# Altium project PCB_pibs_2u.PrjPcb
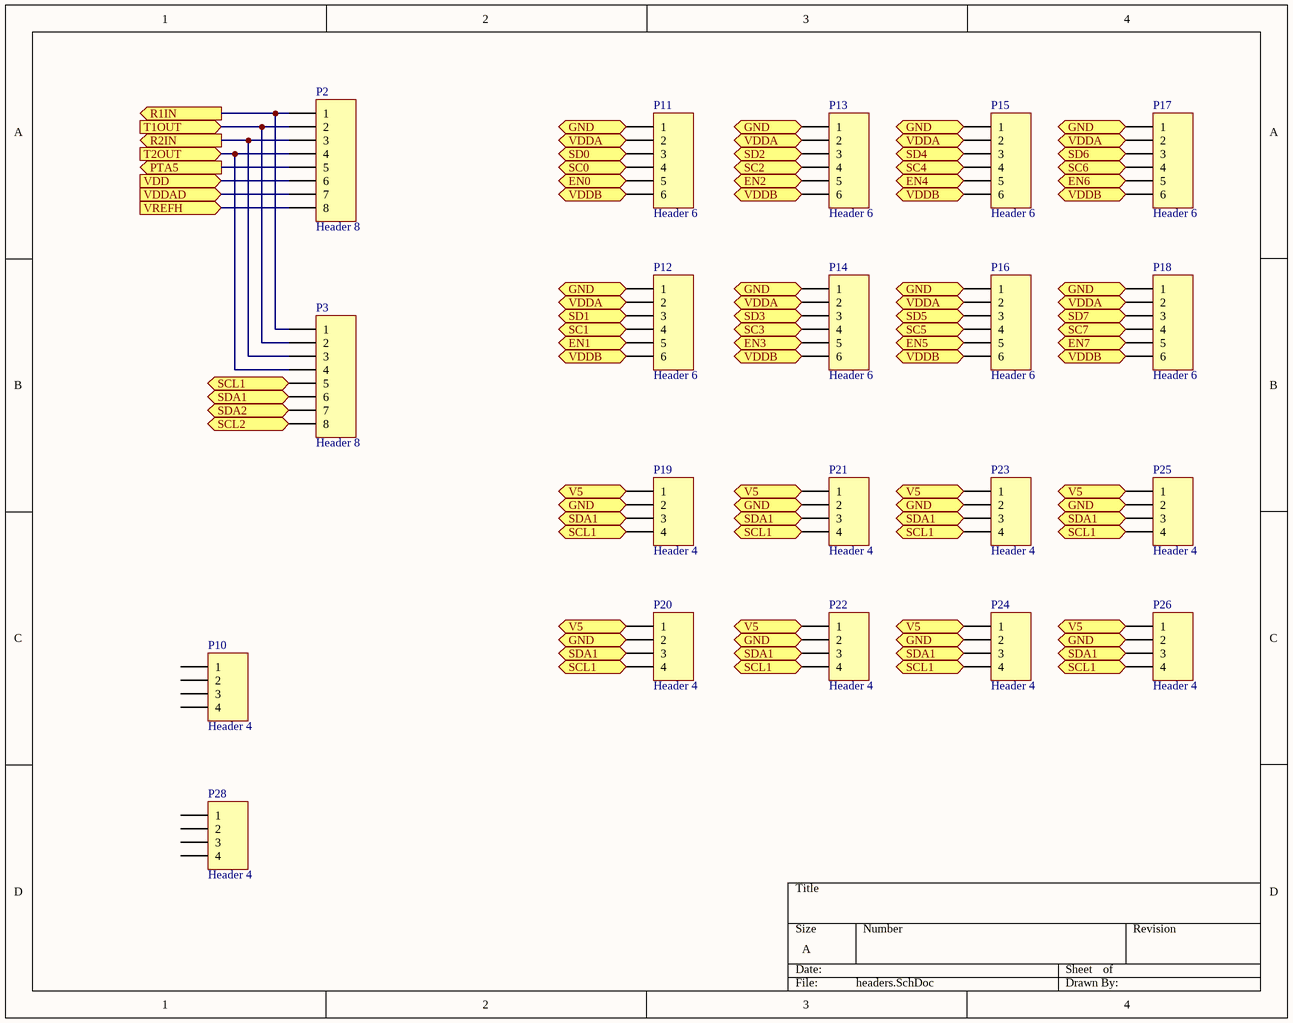
[diagram p0: headers.SchDoc]
8 sheets, 134 parts. Net scope: flat (ports and power ports of the same name join across sheets).
Sheets:
  headers.SchDoc
  power.SchDoc
  digital.SchDoc
  i2c_diff.SchDoc
  i2c_diff_passive.SchDoc
  i2c_rj45.SchDoc
  micro.SchDoc
  wiz810smj.SchDoc

## Sheet headers.SchDoc: Headers
size A

### Parts
P2  Header 8  [HDR1X8]
P3  Header 8  [HDR1X8]
P10  Header 4  [HDR1X4]
P11  Header 6  [HDR1X6]
P12  Header 6  [HDR1X6]
P13  Header 6  [HDR1X6]
P14  Header 6  [HDR1X6]
P15  Header 6  [HDR1X6]
P16  Header 6  [HDR1X6]
P17  Header 6  [HDR1X6]
P18  Header 6  [HDR1X6]
P19  Header 4  [HDR1X4]
P20  Header 4  [HDR1X4]
P21  Header 4  [HDR1X4]
P22  Header 4  [HDR1X4]
P23  Header 4  [HDR1X4]
P24  Header 4  [HDR1X4]
P25  Header 4  [HDR1X4]
P26  Header 4  [HDR1X4]
P28  Header 4  [HDR1X4]

### Ports
EN0 (out), EN1 (out), EN2 (out), EN3 (out), EN4 (out), EN5 (out), EN6 (out), EN7 (out), GND (in), GND (out), PTA5 (out), R1IN (out), R2IN (out), SC0 (bidir), SC1 (bidir), SC2 (bidir), SC3 (bidir), SC4 (bidir), SC5 (bidir), SC6 (bidir), SC7 (bidir), SCL1 (in), SCL2 (in), SD0 (bidir), SD1 (bidir), SD2 (bidir), SD3 (bidir), SD4 (bidir), SD5 (bidir), SD6 (bidir), SD7 (bidir), SDA1 (in), SDA2 (in), T1OUT (in), T2OUT (in), V5 (in), VDD (in), VDDA (out), VDDAD (in), VDDB (out), VREFH (in)

### Nets
GND: P2.7 P2.8 P11.2 P12.2 P13.2 P14.2 P15.2 P16.2 P17.2 P18.2 ; port VDDA, port VDDAD, port VREFH
NetC8_2: P2.5 ; port PTA5
NetC26_2: P11.6 P12.6 P13.6 P14.6 P15.6 P16.6 P17.6 P18.6 ; port VDDB
NetP2_1: P2.1 P3.1 ; port R1IN
NetP2_2: P2.2 P3.2 ; port T1OUT
NetP2_3: P2.3 P3.3 ; port R2IN
NetP2_4: P2.4 P3.4 ; port T2OUT
NetP2_6: P2.6 ; port VDD
NetP3_5: P3.5 P19.4 P20.4 P21.4 P22.4 P23.4 P24.4 P25.4 P26.4 ; port SCL1
NetP3_6: P3.6 P19.3 P20.3 P21.3 P22.3 P23.3 P24.3 P25.3 P26.3 ; port SDA1
NetP3_7: P3.7 ; port SDA2
NetP3_8: P3.8 ; port SCL2
NetP11_1: P11.1 P12.1 P13.1 P14.1 P15.1 P16.1 P17.1 P18.1 P19.2 P20.2 P21.2 P22.2 P23.2 P24.2 P25.2 P26.2 ; port GND
NetP11_3: P11.3 ; port SD0
NetP11_4: P11.4 ; port SC0
NetP11_5: P11.5 ; port EN0
NetP12_3: P12.3 ; port SD1
NetP12_4: P12.4 ; port SC1
NetP12_5: P12.5 ; port EN1
NetP13_3: P13.3 ; port SD2
NetP13_4: P13.4 ; port SC2
NetP13_5: P13.5 ; port EN2
NetP14_3: P14.3 ; port SD3
NetP14_4: P14.4 ; port SC3
NetP14_5: P14.5 ; port EN3
NetP15_3: P15.3 ; port SD4
NetP15_4: P15.4 ; port SC4
NetP15_5: P15.5 ; port EN4
NetP16_3: P16.3 ; port SD5
NetP16_4: P16.4 ; port SC5
NetP16_5: P16.5 ; port EN5
NetP17_3: P17.3 ; port SD6
NetP17_4: P17.4 ; port SC6
NetP17_5: P17.5 ; port EN6
NetP18_3: P18.3 ; port SD7
NetP18_4: P18.4 ; port SC7
NetP18_5: P18.5 ; port EN7
NetP19_1: P19.1 P20.1 P21.1 P22.1 P23.1 P24.1 P25.1 P26.1 ; port V5

Not connected (* = marked no-connect by the designer): P10 1 2 3 4; P28 1 2 3 4

### Library data of the parts
P2 P3 = Header 8: Header, 8-Pin; LatestRevisionDate: 17-Jul-2002; LatestRevisionNote: Re-released for DXP Platform.; Publisher: Altium Limited
P10 P19-P26 P28 = Header 4: Header, 4-Pin; LatestRevisionDate: 17-Jul-2002; LatestRevisionNote: Re-released for DXP Platform.; Publisher: Altium Limited
P11-P18 = Header 6: Header, 6-Pin; LatestRevisionDate: 17-Jul-2002; LatestRevisionNote: Re-released for DXP Platform.; Publisher: Altium Limited

## Sheet power.SchDoc
size A
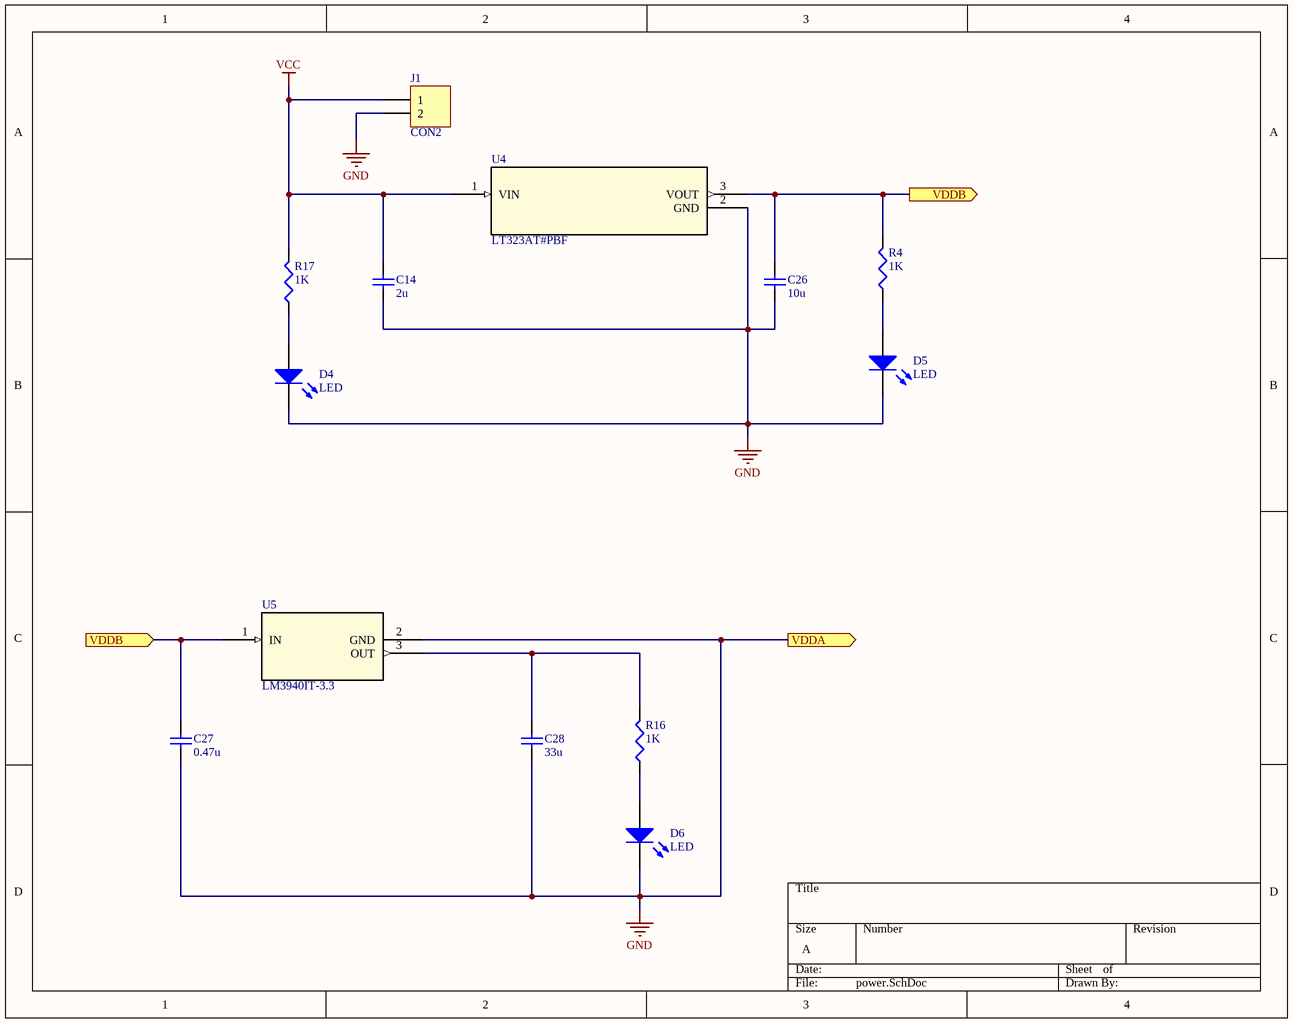
[diagram p1: power.SchDoc]

### Parts
C14  2u  [C1206]
C26  10u  [C1206]
C27  0.47u  [C1206]
C28  33u  [C1206]
D4  LED  [3.2X1.6X1.1]
D5  LED  [3.2X1.6X1.1]
D6  LED  [3.2X1.6X1.1]
J1  CON2  [HDR1X2]
R4  1K  [J1-0603]
R16  1K  [J1-0603]
R17  1K  [J1-0603]
U4  LT323AT#PBF  [TO220-3_T_LIT]
U5  LM3940IT-3.3  [T03B]

### Ports
VDDA (out), VDDB (in), VDDB (out)

### Nets
GND: C14.1 C26.1 C27.1 C28.1 D4.2(K) D5.2(K) D6.2(K) J1.2 U4.2(GND) U5.2(GND) ; port VDDA
VCC: C14.2 J1.1 R17.2 U4.1(VIN)
NetC26_2: C26.2 C27.2 R4.2 U4.3(VOUT) U5.1(IN) ; port VDDB
NetC28_2: C28.2 R16.2 U5.3(OUT)
NetD4_1: D4.1(A) R17.1
NetD5_1: D5.1(A) R4.1
NetD6_1: D6.1(A) R16.1

### Library data of the parts
C14 C26-C28 = Cap Semi: Capacitor (Semiconductor SIM Model); Value: 100pF; Published: 8-Jun-2000; LatestRevisionDate: 29-May-2009; LatestRevisionNote: IPC-7351 Footprint Added.; PackageReference: C1206; Publisher: Altium Limited; PackageDescription: Chip Capacitor
D4-D6 = LED2: Typical RED, GREEN, YELLOW, AMBER GaAs LED; Published: 8-Jun-2000; LatestRevisionDate: 17-Jul-2002; LatestRevisionNote: Re-released for DXP Platform.; PackageVersion: Feb-2002; PackageReference: 3.2X1.6X1.1; Publisher: Altium Limited; PackageDescription: SM LED; 2 Flat Leads
J1 = Header 2: Header, 2-Pin; LatestRevisionDate: 17-Jul-2002; LatestRevisionNote: Re-released for DXP Platform.; Publisher: Altium Limited
R4 R16 R17 = Res3: Published: 8-Jun-2000; LatestRevisionDate: 29-May-2009; LatestRevisionNote: IPC-7351 Footprint Added.; PackageReference: J1-0603; Publisher: Altium Limited; PackageDescription: Chip Resistor; Value: 1K
U4 = LT323AT#PBF: No Description Available; Mfr_Name: Analog Devices / Linear Technology; Copyright: Copyright (C) 2022 Ultra Librarian. All rights reserved.; Manufacturer_Part_Number: LT323AT#PBF; Digi-Key_Part_Number_1: LT323AT#PBF-ND; RefDes: RefDes; Type: DEV
U5 = LM3940IT-3.3: No Description Available; Mfr_Name: Texas Instruments; Type: DEV; Copyright: Copyright (C) 2022 Ultra Librarian. All rights reserved.; Manufacturer_Part_Number: LM3940IT-3.3; RefDes: RefDes

## Sheet digital.SchDoc
size A
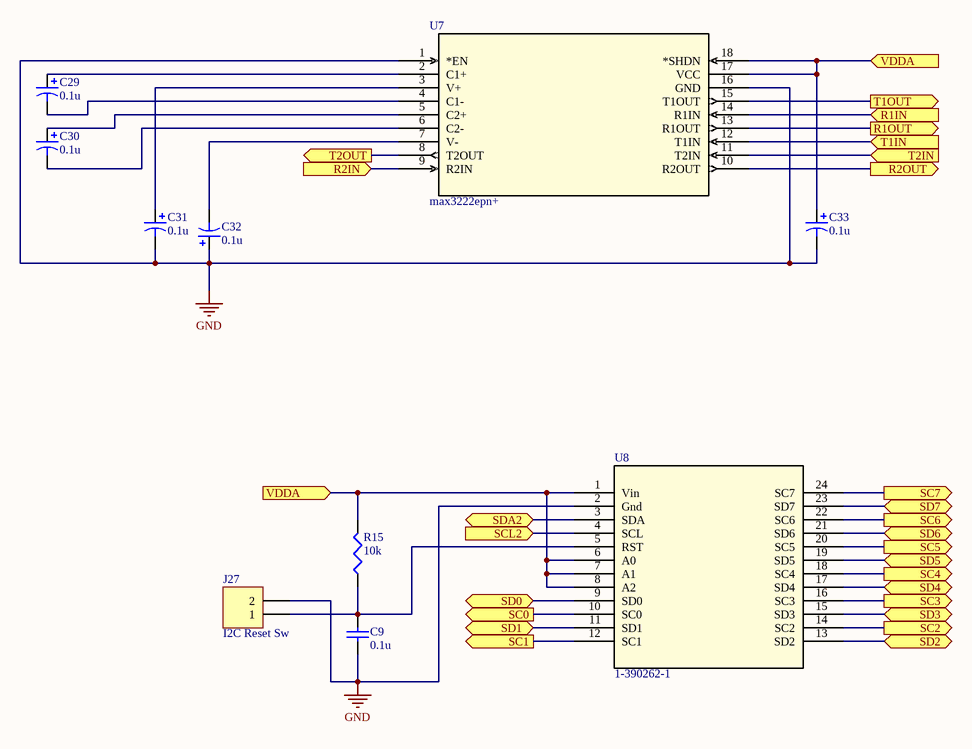
[diagram p2: digital.SchDoc]

### Parts
C9  0.1u  [C1206]
C29  0.1u  [C0805]
C30  0.1u  [C0805]
C31  0.1u  [C0805]
C32  0.1u  [C0805]
C33  0.1u  [C0805]
J27  I2C Reset Sw  [HDR1X2]
R15  10k  [J1-0603]
U7  max3222epn+  [21-0043D_18_MXM]
U8  1-390262-1  [1-390262-1_TYC]

### Ports
R1IN (in), R1OUT (out), R2IN (in), R2OUT (out), SC0 (out), SC1 (out), SC2 (out), SC3 (out), SC4 (out), SC5 (out), SC6 (out), SC7 (out), SCL2 (in), SD0 (bidir), SD1 (bidir), SD2 (bidir), SD3 (bidir), SD4 (bidir), SD5 (bidir), SD6 (bidir), SD7 (bidir), SDA2 (bidir), T1IN (in), T1OUT (out), T2IN (in), T2OUT (out), VDDA (in)

### Nets
GND: C9.1 C31.2 C32.1 C33.1 C33.2 J27.2 R15.2 U7.1(*EN) U7.16(GND) U7.17(VCC) U7.18(*SHDN) U8.1(Vin) U8.2(Gnd) U8.6(A0) U8.7(A1) U8.8(A2) ; port VDDA
NetC9_2: C9.2 J27.1 R15.1 U8.5(RST)
NetC29_1: C29.1 U7.2(C1+)
NetC29_2: C29.2 U7.4(C1-)
NetC30_1: C30.1 U7.5(C2+)
NetC30_2: C30.2 U7.6(C2-)
NetC31_1: C31.1 U7.3(V+)
NetC32_2: C32.2 U7.7(V-)
NetP2_1: U7.14(R1IN) ; port R1IN
NetP2_2: U7.15(T1OUT) ; port T1OUT
NetP2_3: U7.9(R2IN) ; port R2IN
NetP2_4: U7.8(T2OUT) ; port T2OUT
NetP3_7: U8.3(SDA) ; port SDA2
NetP3_8: U8.4(SCL) ; port SCL2
NetP11_3: U8.9(SD0) ; port SD0
NetP11_4: U8.10(SC0) ; port SC0
NetP12_3: U8.11(SD1) ; port SD1
NetP12_4: U8.12(SC1) ; port SC1
NetP13_3: U8.13(SD2) ; port SD2
NetP13_4: U8.14(SC2) ; port SC2
NetP14_3: U8.15(SD3) ; port SD3
NetP14_4: U8.16(SC3) ; port SC3
NetP15_3: U8.17(SD4) ; port SD4
NetP15_4: U8.18(SC4) ; port SC4
NetP16_3: U8.19(SD5) ; port SD5
NetP16_4: U8.20(SC5) ; port SC5
NetP17_3: U8.21(SD6) ; port SD6
NetP17_4: U8.22(SC6) ; port SC6
NetP18_3: U8.23(SD7) ; port SD7
NetP18_4: U8.24(SC7) ; port SC7
NetU7_10: U7.10(R2OUT) ; port R2OUT
NetU7_11: U7.11(T2IN) ; port T2IN
NetU7_12: U7.12(T1IN) ; port T1IN
NetU7_13: U7.13(R1OUT) ; port R1OUT

### Library data of the parts
C9 = Cap Semi: as C14 on sheet power; Published: 8-Jun-2000; LatestRevisionDate: 29-May-2009; LatestRevisionNote: IPC-7351 Footprint Added.; PackageReference: C1206; Publisher: Altium Limited; PackageDescription: Chip Capacitor
C29-C33 = Cap Pol3: Polarized Capacitor (Surface Mount); Value: 100pF; Published: 8-Jun-2000; LatestRevisionDate: 29-May-2009; LatestRevisionNote: IPC-7351 Footprint Added.; PackageReference: C0805; Publisher: Altium Limited; PackageDescription: Chip Capacitor
J27 = Header 2: LatestRevisionDate: 17-Jul-2002; LatestRevisionNote: Re-released for DXP Platform.; Publisher: Altium Limited
R15 = Res3: Resistor; Value: 1K; Published: 8-Jun-2000; LatestRevisionDate: 29-May-2009; LatestRevisionNote: IPC-7351 Footprint Added.; PackageReference: J1-0603; Publisher: Altium Limited; PackageDescription: Chip Resistor
U7 = max3222epn+: No Description Available; Mfr_Name: Maxim Integrated Products; Copyright: Copyright (C) 2022 Ultra Librarian. All rights reserved.; Manufacturer_Part_Number: max3222epn+; Digi-Key_Part_Number_1: MAX3222EPN+-ND; RefDes: RefDes; Type: DEV
U8 = 1-390262-1: No Description Available; Mfr_Name: TE Connectivity; Copyright: Copyright (C) 2022 Ultra Librarian. All rights reserved.; Manufacturer_Part_Number: 1-390262-1; RefDes: RefDes; Type: DEV

## Sheet i2c_diff.SchDoc
size A
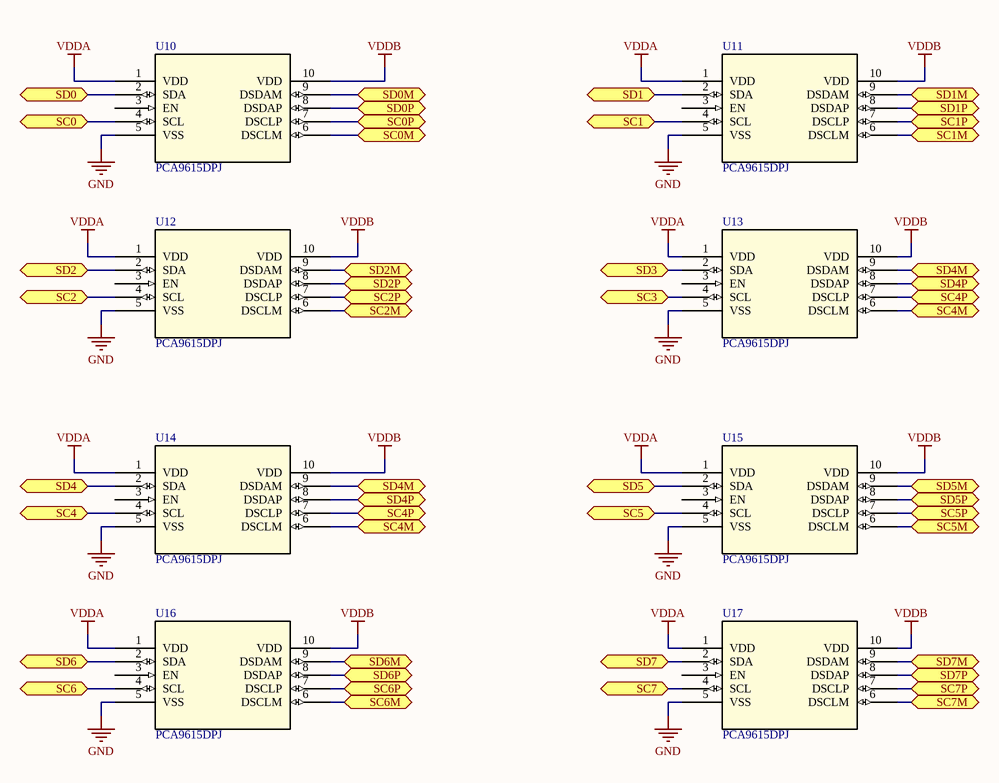
[diagram p3: i2c_diff.SchDoc]

### Parts
(Parts that share a designator on the sheet are numbered #1, #2 ... from top to bottom, then left to right.)
U10  PCA9615DPJ  [TSSOP10_3P1X3P1_NXP]
U11#1  PCA9615DPJ  [TSSOP10_3P1X3P1_NXP]
U12  PCA9615DPJ  [TSSOP10_3P1X3P1_NXP]
U13  PCA9615DPJ  [TSSOP10_3P1X3P1_NXP]
U14  PCA9615DPJ  [TSSOP10_3P1X3P1_NXP]
U15  PCA9615DPJ  [TSSOP10_3P1X3P1_NXP]
U16  PCA9615DPJ  [TSSOP10_3P1X3P1_NXP]
U17  PCA9615DPJ  [TSSOP10_3P1X3P1_NXP]

### Ports
SC0 (bidir), SC0M (bidir), SC0P (bidir), SC1 (bidir), SC1M (bidir), SC1P (bidir), SC2 (bidir), SC2M (bidir), SC2P (bidir), SC3 (bidir), SC4 (bidir), SC4M (bidir), SC4P (bidir), SC5 (bidir), SC5M (bidir), SC5P (bidir), SC6 (bidir), SC6M (bidir), SC6P (bidir), SC7 (bidir), SC7M (bidir), SC7P (bidir), SD0 (bidir), SD0M (bidir), SD0P (bidir), SD1 (bidir), SD1M (bidir), SD1P (bidir), SD2 (bidir), SD2M (bidir), SD2P (bidir), SD3 (bidir), SD4 (bidir), SD4M (bidir), SD4P (bidir), SD5 (bidir), SD5M (bidir), SD5P (bidir), SD6 (bidir), SD6M (bidir), SD6P (bidir), SD7 (bidir), SD7M (bidir), SD7P (bidir)

### Nets
GND: U10.1(VDD) U10.5(VSS) U11#1.1(VDD) U11#1.5(VSS) U12.1(VDD) U12.5(VSS) U13.1(VDD) U13.5(VSS) U14.1(VDD) U14.5(VSS) U15.1(VDD) U15.5(VSS) U16.1(VDD) U16.5(VSS) U17.1(VDD) U17.5(VSS)  [also labelled VDDA]
VDDB: U10.10(VDD) U11#1.10(VDD) U12.10(VDD) U13.10(VDD) U14.10(VDD) U15.10(VDD) U16.10(VDD) U17.10(VDD)
NetJ10_1: U10.6(DSCLM) ; port SC0M
NetJ10_2: U10.7(DSCLP) ; port SC0P
NetJ10_7: U10.9(DSDAM) ; port SD0M
NetJ10_8: U10.8(DSDAP) ; port SD0P
NetJ11_1: U11#1.6(DSCLM) ; port SC1M
NetJ11_2: U11#1.7(DSCLP) ; port SC1P
NetJ11_7: U11#1.9(DSDAM) ; port SD1M
NetJ11_8: U11#1.8(DSDAP) ; port SD1P
NetJ12_1: U12.6(DSCLM) ; port SC2M
NetJ12_2: U12.7(DSCLP) ; port SC2P
NetJ12_7: U12.9(DSDAM) ; port SD2M
NetJ12_8: U12.8(DSDAP) ; port SD2P
NetJ14_1: U13.6(DSCLM) U14.6(DSCLM) ; port SC4M
NetJ14_2: U13.7(DSCLP) U14.7(DSCLP) ; port SC4P
NetJ14_7: U13.9(DSDAM) U14.9(DSDAM) ; port SD4M
NetJ14_8: U13.8(DSDAP) U14.8(DSDAP) ; port SD4P
NetJ15_1: U15.6(DSCLM) ; port SC5M
NetJ15_2: U15.7(DSCLP) ; port SC5P
NetJ15_7: U15.9(DSDAM) ; port SD5M
NetJ15_8: U15.8(DSDAP) ; port SD5P
NetJ16_1: U16.6(DSCLM) ; port SC6M
NetJ16_2: U16.7(DSCLP) ; port SC6P
NetJ16_7: U16.9(DSDAM) ; port SD6M
NetJ16_8: U16.8(DSDAP) ; port SD6P
NetJ17_1: U17.6(DSCLM) ; port SC7M
NetJ17_2: U17.7(DSCLP) ; port SC7P
NetJ17_7: U17.9(DSDAM) ; port SD7M
NetJ17_8: U17.8(DSDAP) ; port SD7P
NetP11_3: U10.2(SDA) ; port SD0
NetP11_4: U10.4(SCL) ; port SC0
NetP12_3: U11#1.2(SDA) ; port SD1
NetP12_4: U11#1.4(SCL) ; port SC1
NetP13_3: U12.2(SDA) ; port SD2
NetP13_4: U12.4(SCL) ; port SC2
NetP14_3: U13.2(SDA) ; port SD3
NetP14_4: U13.4(SCL) ; port SC3
NetP15_3: U14.2(SDA) ; port SD4
NetP15_4: U14.4(SCL) ; port SC4
NetP16_3: U15.2(SDA) ; port SD5
NetP16_4: U15.4(SCL) ; port SC5
NetP17_3: U16.2(SDA) ; port SD6
NetP17_4: U16.4(SCL) ; port SC6
NetP18_3: U17.2(SDA) ; port SD7
NetP18_4: U17.4(SCL) ; port SC7

Not connected (* = marked no-connect by the designer): U10 3(EN); U11#1 3(EN); U12 3(EN); U13 3(EN); U14 3(EN); U15 3(EN); U16 3(EN); U17 3(EN)

### Library data of the parts
U10 U11#1 U12-U17 = PCA9615DPJ: No Description Available; Mfr_Name: NXP; Copyright: Copyright (C) 2022 Ultra Librarian. All rights reserved.; Manufacturer_Part_Number: PCA9615DPJ; RefDes: RefDes; Type: DEV

## Sheet i2c_diff_passive.SchDoc
size A
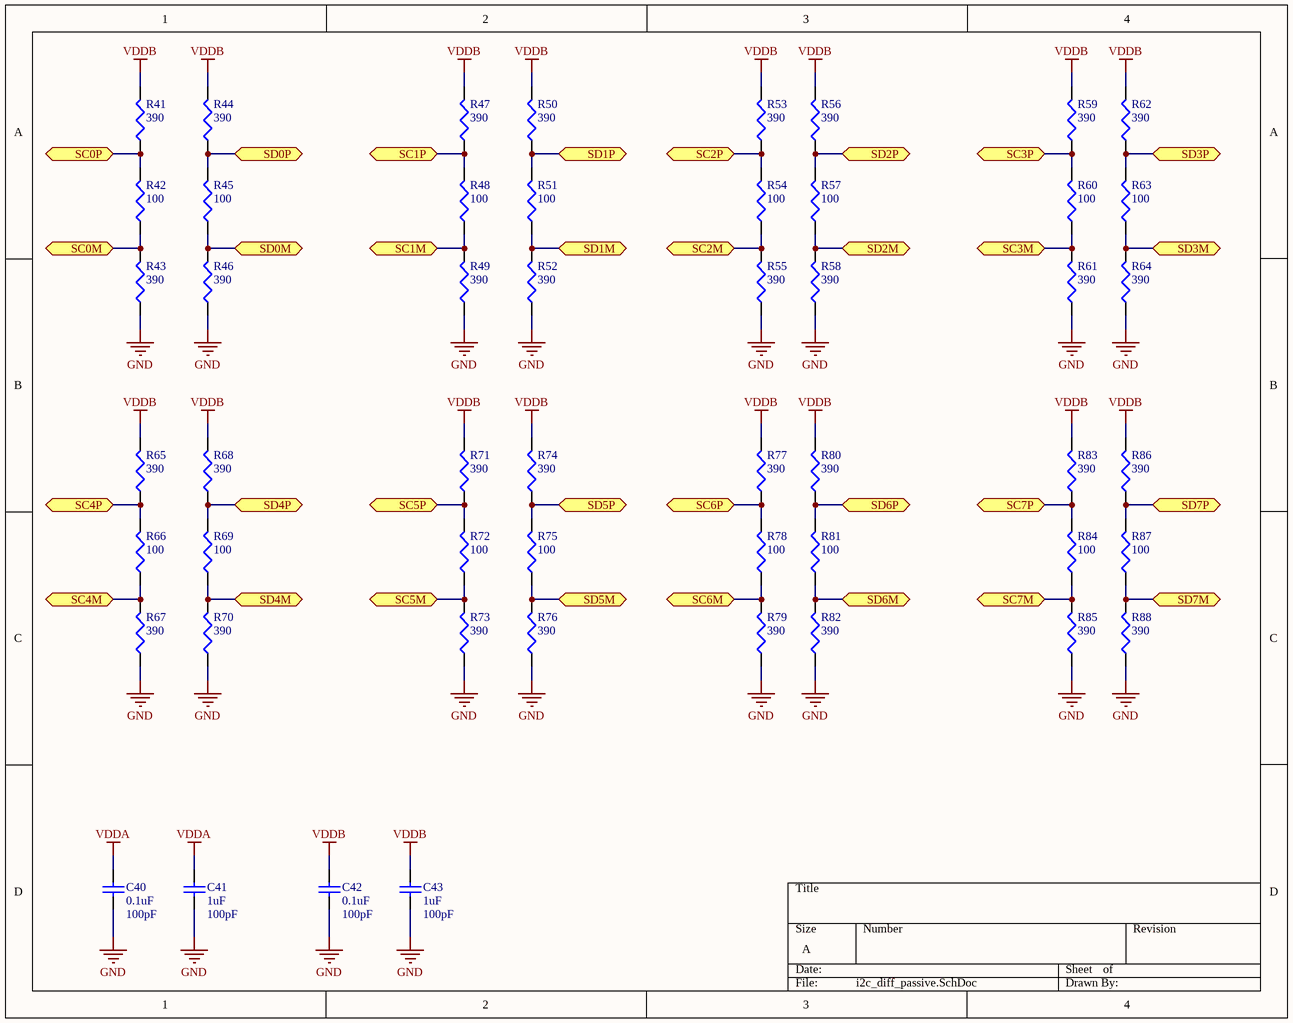
[diagram p4: i2c_diff_passive.SchDoc]

### Parts
C40  0.1uF  value 100pF  [C1206]
C41  1uF  value 100pF  [C1206]
C42  0.1uF  value 100pF  [C1206]
C43  1uF  value 100pF  [C1206]
R41  390  [J1-0603]
R42  100  [J1-0603]
R43  390  [J1-0603]
R44  390  [J1-0603]
R45  100  [J1-0603]
R46  390  [J1-0603]
R47  390  [J1-0603]
R48  100  [J1-0603]
R49  390  [J1-0603]
R50  390  [J1-0603]
R51  100  [J1-0603]
R52  390  [J1-0603]
R53  390  [J1-0603]
R54  100  [J1-0603]
R55  390  [J1-0603]
R56  390  [J1-0603]
R57  100  [J1-0603]
R58  390  [J1-0603]
R59  390  [J1-0603]
R60  100  [J1-0603]
R61  390  [J1-0603]
R62  390  [J1-0603]
R63  100  [J1-0603]
R64  390  [J1-0603]
R65  390  [J1-0603]
R66  100  [J1-0603]
R67  390  [J1-0603]
R68  390  [J1-0603]
R69  100  [J1-0603]
R70  390  [J1-0603]
R71  390  [J1-0603]
R72  100  [J1-0603]
R73  390  [J1-0603]
R74  390  [J1-0603]
R75  100  [J1-0603]
R76  390  [J1-0603]
R77  390  [J1-0603]
R78  100  [J1-0603]
R79  390  [J1-0603]
R80  390  [J1-0603]
R81  100  [J1-0603]
R82  390  [J1-0603]
R83  390  [J1-0603]
R84  100  [J1-0603]
R85  390  [J1-0603]
R86  390  [J1-0603]
R87  100  [J1-0603]
R88  390  [J1-0603]

### Ports
SC0M (bidir), SC0P (bidir), SC1M (bidir), SC1P (bidir), SC2M (bidir), SC2P (bidir), SC3M (bidir), SC3P (bidir), SC4M (bidir), SC4P (bidir), SC5M (bidir), SC5P (bidir), SC6M (bidir), SC6P (bidir), SC7M (bidir), SC7P (bidir), SD0M (bidir), SD0P (bidir), SD1M (bidir), SD1P (bidir), SD2M (bidir), SD2P (bidir), SD3M (bidir), SD3P (bidir), SD4M (bidir), SD4P (bidir), SD5M (bidir), SD5P (bidir), SD6M (bidir), SD6P (bidir), SD7M (bidir), SD7P (bidir)

### Nets
GND: C40.1 C40.2 C41.1 C41.2 C42.1 C43.1 R43.1 R46.1 R49.1 R52.1 R55.1 R58.1 R61.1 R64.1 R67.1 R70.1 R73.1 R76.1 R79.1 R82.1 R85.1 R88.1  [also labelled VDDA]
VDDB: C42.2 C43.2 R41.2 R44.2 R47.2 R50.2 R53.2 R56.2 R59.2 R62.2 R65.2 R68.2 R71.2 R74.2 R77.2 R80.2 R83.2 R86.2
NetJ10_1: R42.1 R43.2 ; port SC0M
NetJ10_2: R41.1 R42.2 ; port SC0P
NetJ10_7: R45.1 R46.2 ; port SD0M
NetJ10_8: R44.1 R45.2 ; port SD0P
NetJ11_1: R48.1 R49.2 ; port SC1M
NetJ11_2: R47.1 R48.2 ; port SC1P
NetJ11_7: R51.1 R52.2 ; port SD1M
NetJ11_8: R50.1 R51.2 ; port SD1P
NetJ12_1: R54.1 R55.2 ; port SC2M
NetJ12_2: R53.1 R54.2 ; port SC2P
NetJ12_7: R57.1 R58.2 ; port SD2M
NetJ12_8: R56.1 R57.2 ; port SD2P
NetJ13_1: R60.1 R61.2 ; port SC3M
NetJ13_2: R59.1 R60.2 ; port SC3P
NetJ13_7: R63.1 R64.2 ; port SD3M
NetJ14_1: R66.1 R67.2 ; port SC4M
NetJ14_2: R65.1 R66.2 ; port SC4P
NetJ14_7: R69.1 R70.2 ; port SD4M
NetJ14_8: R68.1 R69.2 ; port SD4P
NetJ15_1: R72.1 R73.2 ; port SC5M
NetJ15_2: R71.1 R72.2 ; port SC5P
NetJ15_7: R75.1 R76.2 ; port SD5M
NetJ15_8: R74.1 R75.2 ; port SD5P
NetJ16_1: R78.1 R79.2 ; port SC6M
NetJ16_2: R77.1 R78.2 ; port SC6P
NetJ16_7: R81.1 R82.2 ; port SD6M
NetJ16_8: R80.1 R81.2 ; port SD6P
NetJ17_1: R84.1 R85.2 ; port SC7M
NetJ17_2: R83.1 R84.2 ; port SC7P
NetJ17_7: R87.1 R88.2 ; port SD7M
NetJ17_8: R86.1 R87.2 ; port SD7P
NetR62_1: R62.1 R63.2 ; port SD3P

### Library data of the parts
C40-C43 = Cap Semi: Capacitor (Semiconductor SIM Model); Published: 8-Jun-2000; LatestRevisionDate: 29-May-2009; LatestRevisionNote: IPC-7351 Footprint Added.; PackageReference: C1206; Publisher: Altium Limited; PackageDescription: Chip Capacitor
R41-R88 = Res3: Resistor; Value: 1K; Published: 8-Jun-2000; LatestRevisionDate: 29-May-2009; LatestRevisionNote: IPC-7351 Footprint Added.; PackageReference: J1-0603; Publisher: Altium Limited; PackageDescription: Chip Resistor

## Sheet i2c_rj45.SchDoc
size A
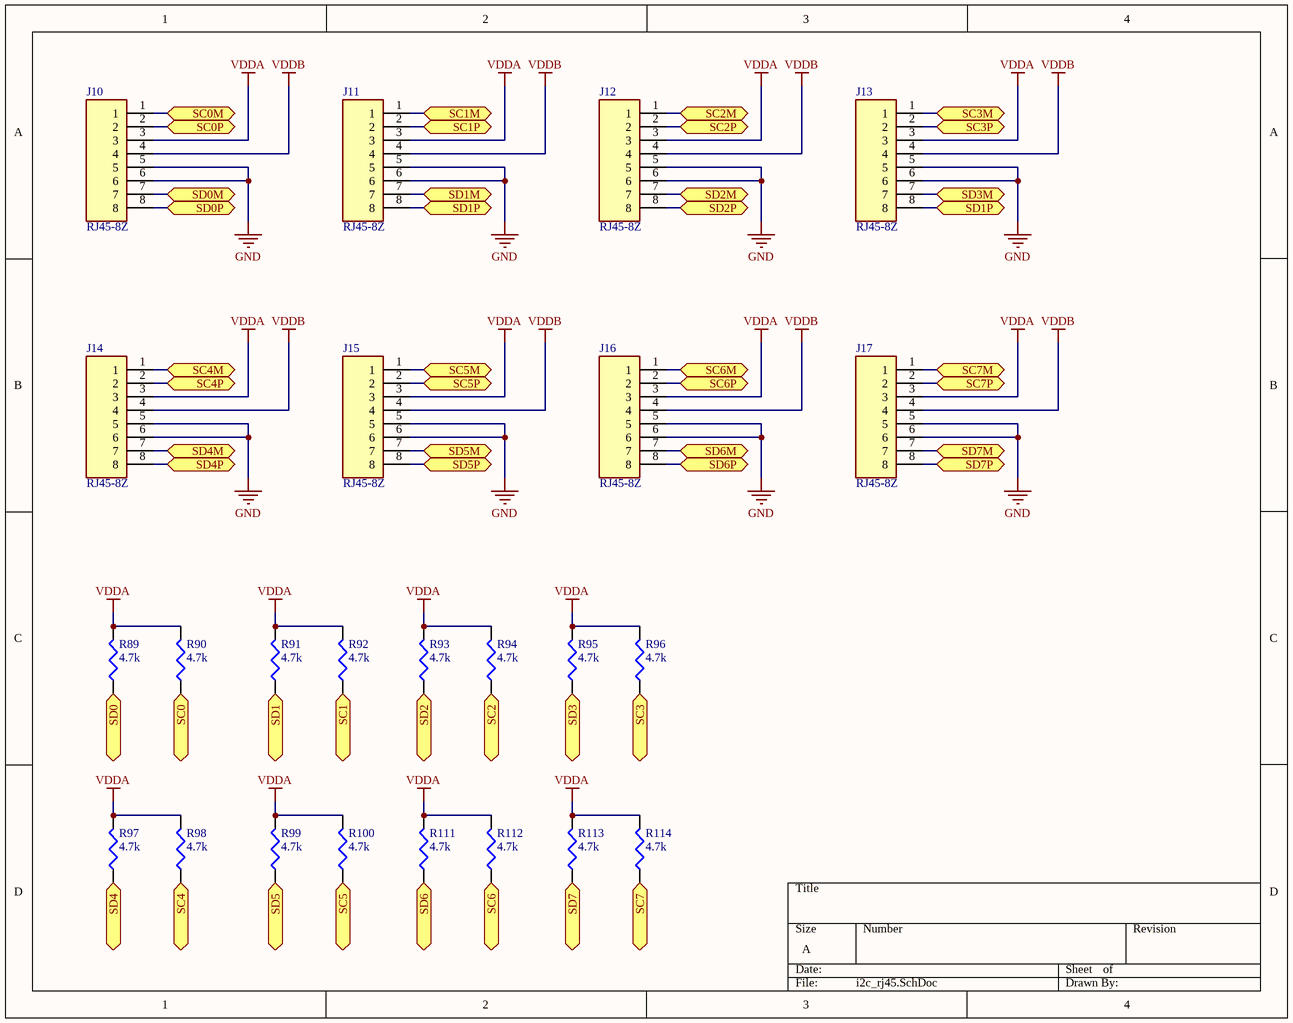
[diagram p5: i2c_rj45.SchDoc]

### Parts
J10  RJ45-8Z  [CONN_RJ45-8Z]
J11  RJ45-8Z  [CONN_RJ45-8Z]
J12  RJ45-8Z  [CONN_RJ45-8Z]
J13  RJ45-8Z  [CONN_RJ45-8Z]
J14  RJ45-8Z  [CONN_RJ45-8Z]
J15  RJ45-8Z  [CONN_RJ45-8Z]
J16  RJ45-8Z  [CONN_RJ45-8Z]
J17  RJ45-8Z  [CONN_RJ45-8Z]
R89  4.7k  [J1-0603]
R90  4.7k  [J1-0603]
R91  4.7k  [J1-0603]
R92  4.7k  [J1-0603]
R93  4.7k  [J1-0603]
R94  4.7k  [J1-0603]
R95  4.7k  [J1-0603]
R96  4.7k  [J1-0603]
R97  4.7k  [J1-0603]
R98  4.7k  [J1-0603]
R99  4.7k  [J1-0603]
R100  4.7k  [J1-0603]
R111  4.7k  [J1-0603]
R112  4.7k  [J1-0603]
R113  4.7k  [J1-0603]
R114  4.7k  [J1-0603]

### Ports
SC0 (bidir), SC0M (bidir), SC0P (bidir), SC1 (bidir), SC1M (bidir), SC1P (bidir), SC2 (bidir), SC2M (bidir), SC2P (bidir), SC3 (bidir), SC3M (bidir), SC3P (bidir), SC4 (bidir), SC4M (bidir), SC4P (bidir), SC5 (bidir), SC5M (bidir), SC5P (bidir), SC6 (bidir), SC6M (bidir), SC6P (bidir), SC7 (bidir), SC7M (bidir), SC7P (bidir), SD0 (bidir), SD0M (bidir), SD0P (bidir), SD1 (bidir), SD1M (bidir), SD1P (bidir), SD2 (bidir), SD2M (bidir), SD2P (bidir), SD3 (bidir), SD3M (bidir), SD4 (bidir), SD4M (bidir), SD4P (bidir), SD5 (bidir), SD5M (bidir), SD5P (bidir), SD6 (bidir), SD6M (bidir), SD6P (bidir), SD7 (bidir), SD7M (bidir), SD7P (bidir)

### Nets
GND: J10.3 J10.5 J10.6 J11.3 J11.5 J11.6 J12.3 J12.5 J12.6 J13.3 J13.5 J13.6 J14.3 J14.5 J14.6 J15.3 J15.5 J15.6 J16.3 J16.5 J16.6 J17.3 J17.5 J17.6 R89.2 R90.2 R91.2 R92.2 R93.2 R94.2 R95.2 R96.2 R97.2 R98.2 R99.2 R100.2 R111.2 R112.2 R113.2 R114.2  [also labelled VDDA]
VDDB: J10.4 J11.4 J12.4 J13.4 J14.4 J15.4 J16.4 J17.4
NetJ10_1: J10.1 ; port SC0M
NetJ10_2: J10.2 ; port SC0P
NetJ10_7: J10.7 ; port SD0M
NetJ10_8: J10.8 ; port SD0P
NetJ11_1: J11.1 ; port SC1M
NetJ11_2: J11.2 ; port SC1P
NetJ11_7: J11.7 ; port SD1M
NetJ11_8: J11.8 J13.8 ; port SD1P
NetJ12_1: J12.1 ; port SC2M
NetJ12_2: J12.2 ; port SC2P
NetJ12_7: J12.7 ; port SD2M
NetJ12_8: J12.8 ; port SD2P
NetJ13_1: J13.1 ; port SC3M
NetJ13_2: J13.2 ; port SC3P
NetJ13_7: J13.7 ; port SD3M
NetJ14_1: J14.1 ; port SC4M
NetJ14_2: J14.2 ; port SC4P
NetJ14_7: J14.7 ; port SD4M
NetJ14_8: J14.8 ; port SD4P
NetJ15_1: J15.1 ; port SC5M
NetJ15_2: J15.2 ; port SC5P
NetJ15_7: J15.7 ; port SD5M
NetJ15_8: J15.8 ; port SD5P
NetJ16_1: J16.1 ; port SC6M
NetJ16_2: J16.2 ; port SC6P
NetJ16_7: J16.7 ; port SD6M
NetJ16_8: J16.8 ; port SD6P
NetJ17_1: J17.1 ; port SC7M
NetJ17_2: J17.2 ; port SC7P
NetJ17_7: J17.7 ; port SD7M
NetJ17_8: J17.8 ; port SD7P
NetP11_3: R89.1 ; port SD0
NetP11_4: R90.1 ; port SC0
NetP12_3: R91.1 ; port SD1
NetP12_4: R92.1 ; port SC1
NetP13_3: R93.1 ; port SD2
NetP13_4: R94.1 ; port SC2
NetP14_3: R95.1 ; port SD3
NetP14_4: R96.1 ; port SC3
NetP15_3: R97.1 ; port SD4
NetP15_4: R98.1 ; port SC4
NetP16_3: R99.1 ; port SD5
NetP16_4: R100.1 ; port SC5
NetP17_3: R111.1 ; port SD6
NetP17_4: R112.1 ; port SC6
NetP18_3: R113.1 ; port SD7
NetP18_4: R114.1 ; port SC7

### Library data of the parts
J10-J17 = RJ45-8Z: Jack Modular Connector 8p8c _RJ45, Ethernet_ 90Â° Angle _Right_ Shielded; MF: TE Connectivity; TE_purchase_URL: https://www.te.com/usa-en/product-RJ45-8Z.html?te_bu=Cor&te_type=disp&te_campaign=seda_glo_cor-seda-global-disp-prtnr-fy19-seda-model-bom-cta_sma-317_1&elqCampaignId=32493; Package: None; MP: RJ45-8Z; Value: *; Availability: Unavailable; SnapEDA_Link: https://www.snapeda.com/parts/RJ45-8Z/TE%20Connectivity%20Corcom%20Filters/view-part/51337/?ref=snap; Price: None
R89-R100 R111-R114 = Res3: Resistor; Value: 1K; Published: 8-Jun-2000; LatestRevisionDate: 29-May-2009; LatestRevisionNote: IPC-7351 Footprint Added.; PackageReference: J1-0603; Publisher: Altium Limited; PackageDescription: Chip Resistor

## Sheet micro.SchDoc
size A
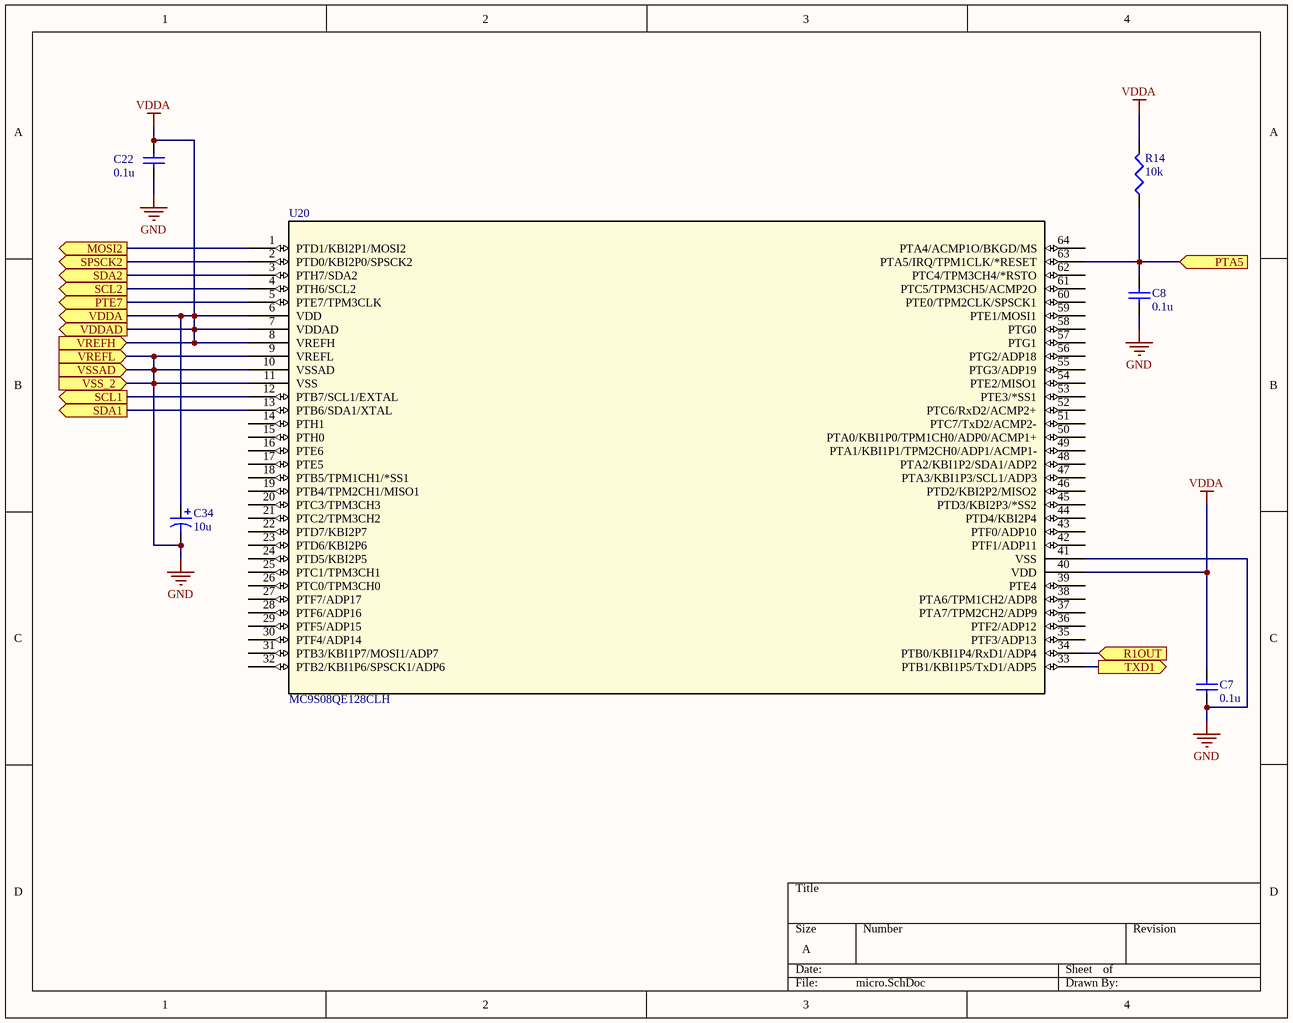
[diagram p6: micro.SchDoc]

### Parts
C7  0.1u  [C1206]
C8  0.1u  [C1206]
C22  0.1u  [C1206]
C34  10u  [C0805]
R14  10k  [J1-0603]
U20  MC9S08QE128CLH  [QFP64_FRE]

### Ports
MOSI2 (out), PTA5 (in), PTE7 (out), R1OUT (in), SCL1 (out), SCL2 (out), SDA1 (out), SDA2 (out), SPSCK2 (out), TXD1 (out), VDDA (out), VDDAD (out), VREFH (in), VREFL (in), VSS_2 (in), VSSAD (in)

### Nets
GND: C7.1 C7.2 C8.1 C22.1 C22.2 C34.1 C34.2 R14.2 U20.6(VDD) U20.7(VDDAD) U20.8(VREFH) U20.9(VREFL) U20.10(VSSAD) U20.11(VSS) U20.40(VDD) U20.41(VSS) ; port VDDA, port VDDAD, port VREFH, port VREFL, port VSSAD, port VSS_2  [also labelled VDDA]
NetC8_2: C8.2 R14.1 U20.63(PTA5/IRQ/TPM1CLK/*RESET) ; port PTA5
NetP3_5: U20.12(PTB7/SCL1/EXTAL) ; port SCL1
NetP3_6: U20.13(PTB6/SDA1/XTAL) ; port SDA1
NetP3_7: U20.3(PTH7/SDA2) ; port SDA2
NetP3_8: U20.4(PTH6/SCL2) ; port SCL2
NetU7_13: U20.34(PTB0/KBI1P4/RxD1/ADP4) ; port R1OUT
NetU20_1: U20.1(PTD1/KBI2P1/MOSI2) ; port MOSI2
NetU20_2: U20.2(PTD0/KBI2P0/SPSCK2) ; port SPSCK2
NetU20_5: U20.5(PTE7/TPM3CLK) ; port PTE7
NetU20_33: U20.33(PTB1/KBI1P5/TxD1/ADP5) ; port TXD1

Not connected (* = marked no-connect by the designer): U20 14(PTH1) 15(PTH0) 16(PTE6) 17(PTE5) 18(PTB5/TPM1CH1/*SS1) 19(PTB4/TPM2CH1/MISO1) 20(PTC3/TPM3CH3) 21(PTC2/TPM3CH2) 22(PTD7/KBI2P7) 23(PTD6/KBI2P6) 24(PTD5/KBI2P5) 25(PTC1/TPM3CH1) 26(PTC0/TPM3CH0) 27(PTF7/ADP17) 28(PTF6/ADP16) 29(PTF5/ADP15) 30(PTF4/ADP14) 31(PTB3/KBI1P7/MOSI1/ADP7) 32(PTB2/KBI1P6/SPSCK1/ADP6) 35(PTF3/ADP13) 36(PTF2/ADP12) 37(PTA7/TPM2CH2/ADP9) 38(PTA6/TPM1CH2/ADP8) 39(PTE4) 42(PTF1/ADP11) 43(PTF0/ADP10) 44(PTD4/KBI2P4) 45(PTD3/KBI2P3/*SS2) 46(PTD2/KBI2P2/MISO2) 47(PTA3/KBI1P3/SCL1/ADP3) 48(PTA2/KBI1P2/SDA1/ADP2) 49(PTA1/KBI1P1/TPM2CH0/ADP1/ACMP1-) 50(PTA0/KBI1P0/TPM1CH0/ADP0/ACMP1+) 51(PTC7/TxD2/ACMP2-) 52(PTC6/RxD2/ACMP2+) 53(PTE3/*SS1) 54(PTE2/MISO1) 55(PTG3/ADP19) 56(PTG2/ADP18) 57(PTG1) 58(PTG0) 59(PTE1/MOSI1) 60(PTE0/TPM2CLK/SPSCK1) 61(PTC5/TPM3CH5/ACMP2O) 62(PTC4/TPM3CH4/*RSTO) 64(PTA4/ACMP1O/BKGD/MS)

### Library data of the parts
C7 C8 C22 = Cap Semi: as C14 on sheet power; Published: 8-Jun-2000; LatestRevisionDate: 29-May-2009; LatestRevisionNote: IPC-7351 Footprint Added.; PackageReference: C1206; Publisher: Altium Limited; PackageDescription: Chip Capacitor
C34 = Cap Pol3: as C29 on sheet digital; Published: 8-Jun-2000; LatestRevisionDate: 29-May-2009; LatestRevisionNote: IPC-7351 Footprint Added.; PackageReference: C0805; Publisher: Altium Limited; PackageDescription: Chip Capacitor
R14 = Res3: Resistor; Value: 1K; Published: 8-Jun-2000; LatestRevisionDate: 29-May-2009; LatestRevisionNote: IPC-7351 Footprint Added.; PackageReference: J1-0603; Publisher: Altium Limited; PackageDescription: Chip Resistor
U20 = MC9S08QE128CLH: No Description Available; Mfr_Name: NXP; Copyright: Copyright (C) 2022 Ultra Librarian. All rights reserved.; Manufacturer_Part_Number: MC9S08QE128CLH; Digi-Key_Part_Number_1: MC9S08QE128CLH-ND; RefDes: RefDes; Type: DEV

## Sheet wiz810smj.SchDoc
size A
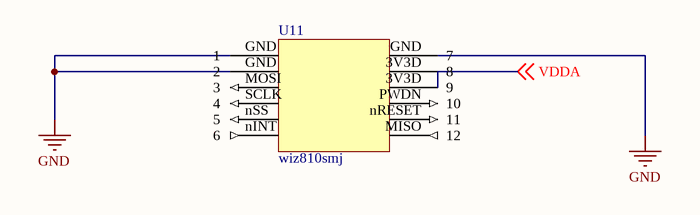
[diagram p7: wiz810smj.SchDoc]

### Parts
(Parts that share a designator on the sheet are numbered #1, #2 ... from top to bottom, then left to right.)
U11#2  wiz810smj

### Nets

Not connected (* = marked no-connect by the designer): U11#2 3V3D(9) GND(1) MISO(12) MOSI(3) nINT(6) nRESET(11) nSS(5) PWDN(10) SCLK(4)

## Nets that join several sheets
GND: headers (10 pins), power (10 pins), digital (16 pins), i2c_diff (16 pins), i2c_diff_passive (22 pins), i2c_rj45 (40 pins), micro (16 pins)
VDDB: i2c_diff (8 pins), i2c_diff_passive (18 pins), i2c_rj45 (8 pins)
NetC8_2: headers (P2.5), micro (C8.2 R14.1 U20.63)
NetC26_2: headers (8 pins), power (5 pins)
NetJ10_1: i2c_diff (U10.6), i2c_diff_passive (R42.1 R43.2), i2c_rj45 (J10.1)
NetJ10_2: i2c_diff (U10.7), i2c_diff_passive (R41.1 R42.2), i2c_rj45 (J10.2)
NetJ10_7: i2c_diff (U10.9), i2c_diff_passive (R45.1 R46.2), i2c_rj45 (J10.7)
NetJ10_8: i2c_diff (U10.8), i2c_diff_passive (R44.1 R45.2), i2c_rj45 (J10.8)
NetJ11_1: i2c_diff (U11#1.6), i2c_diff_passive (R48.1 R49.2), i2c_rj45 (J11.1)
NetJ11_2: i2c_diff (U11#1.7), i2c_diff_passive (R47.1 R48.2), i2c_rj45 (J11.2)
NetJ11_7: i2c_diff (U11#1.9), i2c_diff_passive (R51.1 R52.2), i2c_rj45 (J11.7)
NetJ11_8: i2c_diff (U11#1.8), i2c_diff_passive (R50.1 R51.2), i2c_rj45 (J11.8 J13.8)
NetJ12_1: i2c_diff (U12.6), i2c_diff_passive (R54.1 R55.2), i2c_rj45 (J12.1)
NetJ12_2: i2c_diff (U12.7), i2c_diff_passive (R53.1 R54.2), i2c_rj45 (J12.2)
NetJ12_7: i2c_diff (U12.9), i2c_diff_passive (R57.1 R58.2), i2c_rj45 (J12.7)
NetJ12_8: i2c_diff (U12.8), i2c_diff_passive (R56.1 R57.2), i2c_rj45 (J12.8)
NetJ13_1: i2c_diff_passive (R60.1 R61.2), i2c_rj45 (J13.1)
NetJ13_2: i2c_diff_passive (R59.1 R60.2), i2c_rj45 (J13.2)
NetJ13_7: i2c_diff_passive (R63.1 R64.2), i2c_rj45 (J13.7)
NetJ14_1: i2c_diff (U13.6 U14.6), i2c_diff_passive (R66.1 R67.2), i2c_rj45 (J14.1)
NetJ14_2: i2c_diff (U13.7 U14.7), i2c_diff_passive (R65.1 R66.2), i2c_rj45 (J14.2)
NetJ14_7: i2c_diff (U13.9 U14.9), i2c_diff_passive (R69.1 R70.2), i2c_rj45 (J14.7)
NetJ14_8: i2c_diff (U13.8 U14.8), i2c_diff_passive (R68.1 R69.2), i2c_rj45 (J14.8)
NetJ15_1: i2c_diff (U15.6), i2c_diff_passive (R72.1 R73.2), i2c_rj45 (J15.1)
NetJ15_2: i2c_diff (U15.7), i2c_diff_passive (R71.1 R72.2), i2c_rj45 (J15.2)
NetJ15_7: i2c_diff (U15.9), i2c_diff_passive (R75.1 R76.2), i2c_rj45 (J15.7)
NetJ15_8: i2c_diff (U15.8), i2c_diff_passive (R74.1 R75.2), i2c_rj45 (J15.8)
NetJ16_1: i2c_diff (U16.6), i2c_diff_passive (R78.1 R79.2), i2c_rj45 (J16.1)
NetJ16_2: i2c_diff (U16.7), i2c_diff_passive (R77.1 R78.2), i2c_rj45 (J16.2)
NetJ16_7: i2c_diff (U16.9), i2c_diff_passive (R81.1 R82.2), i2c_rj45 (J16.7)
NetJ16_8: i2c_diff (U16.8), i2c_diff_passive (R80.1 R81.2), i2c_rj45 (J16.8)
NetJ17_1: i2c_diff (U17.6), i2c_diff_passive (R84.1 R85.2), i2c_rj45 (J17.1)
NetJ17_2: i2c_diff (U17.7), i2c_diff_passive (R83.1 R84.2), i2c_rj45 (J17.2)
NetJ17_7: i2c_diff (U17.9), i2c_diff_passive (R87.1 R88.2), i2c_rj45 (J17.7)
NetJ17_8: i2c_diff (U17.8), i2c_diff_passive (R86.1 R87.2), i2c_rj45 (J17.8)
NetP2_1: headers (P2.1 P3.1), digital (U7.14)
NetP2_2: headers (P2.2 P3.2), digital (U7.15)
NetP2_3: headers (P2.3 P3.3), digital (U7.9)
NetP2_4: headers (P2.4 P3.4), digital (U7.8)
NetP3_5: headers (9 pins), micro (U20.12)
NetP3_6: headers (9 pins), micro (U20.13)
NetP3_7: headers (P3.7), digital (U8.3), micro (U20.3)
NetP3_8: headers (P3.8), digital (U8.4), micro (U20.4)
NetP11_3: headers (P11.3), digital (U8.9), i2c_diff (U10.2), i2c_rj45 (R89.1)
NetP11_4: headers (P11.4), digital (U8.10), i2c_diff (U10.4), i2c_rj45 (R90.1)
NetP12_3: headers (P12.3), digital (U8.11), i2c_diff (U11#1.2), i2c_rj45 (R91.1)
NetP12_4: headers (P12.4), digital (U8.12), i2c_diff (U11#1.4), i2c_rj45 (R92.1)
NetP13_3: headers (P13.3), digital (U8.13), i2c_diff (U12.2), i2c_rj45 (R93.1)
NetP13_4: headers (P13.4), digital (U8.14), i2c_diff (U12.4), i2c_rj45 (R94.1)
NetP14_3: headers (P14.3), digital (U8.15), i2c_diff (U13.2), i2c_rj45 (R95.1)
NetP14_4: headers (P14.4), digital (U8.16), i2c_diff (U13.4), i2c_rj45 (R96.1)
NetP15_3: headers (P15.3), digital (U8.17), i2c_diff (U14.2), i2c_rj45 (R97.1)
NetP15_4: headers (P15.4), digital (U8.18), i2c_diff (U14.4), i2c_rj45 (R98.1)
NetP16_3: headers (P16.3), digital (U8.19), i2c_diff (U15.2), i2c_rj45 (R99.1)
NetP16_4: headers (P16.4), digital (U8.20), i2c_diff (U15.4), i2c_rj45 (R100.1)
NetP17_3: headers (P17.3), digital (U8.21), i2c_diff (U16.2), i2c_rj45 (R111.1)
NetP17_4: headers (P17.4), digital (U8.22), i2c_diff (U16.4), i2c_rj45 (R112.1)
NetP18_3: headers (P18.3), digital (U8.23), i2c_diff (U17.2), i2c_rj45 (R113.1)
NetP18_4: headers (P18.4), digital (U8.24), i2c_diff (U17.4), i2c_rj45 (R114.1)
NetU7_13: digital (U7.13), micro (U20.34)